# Altium project BaseBoard.PrjPcb
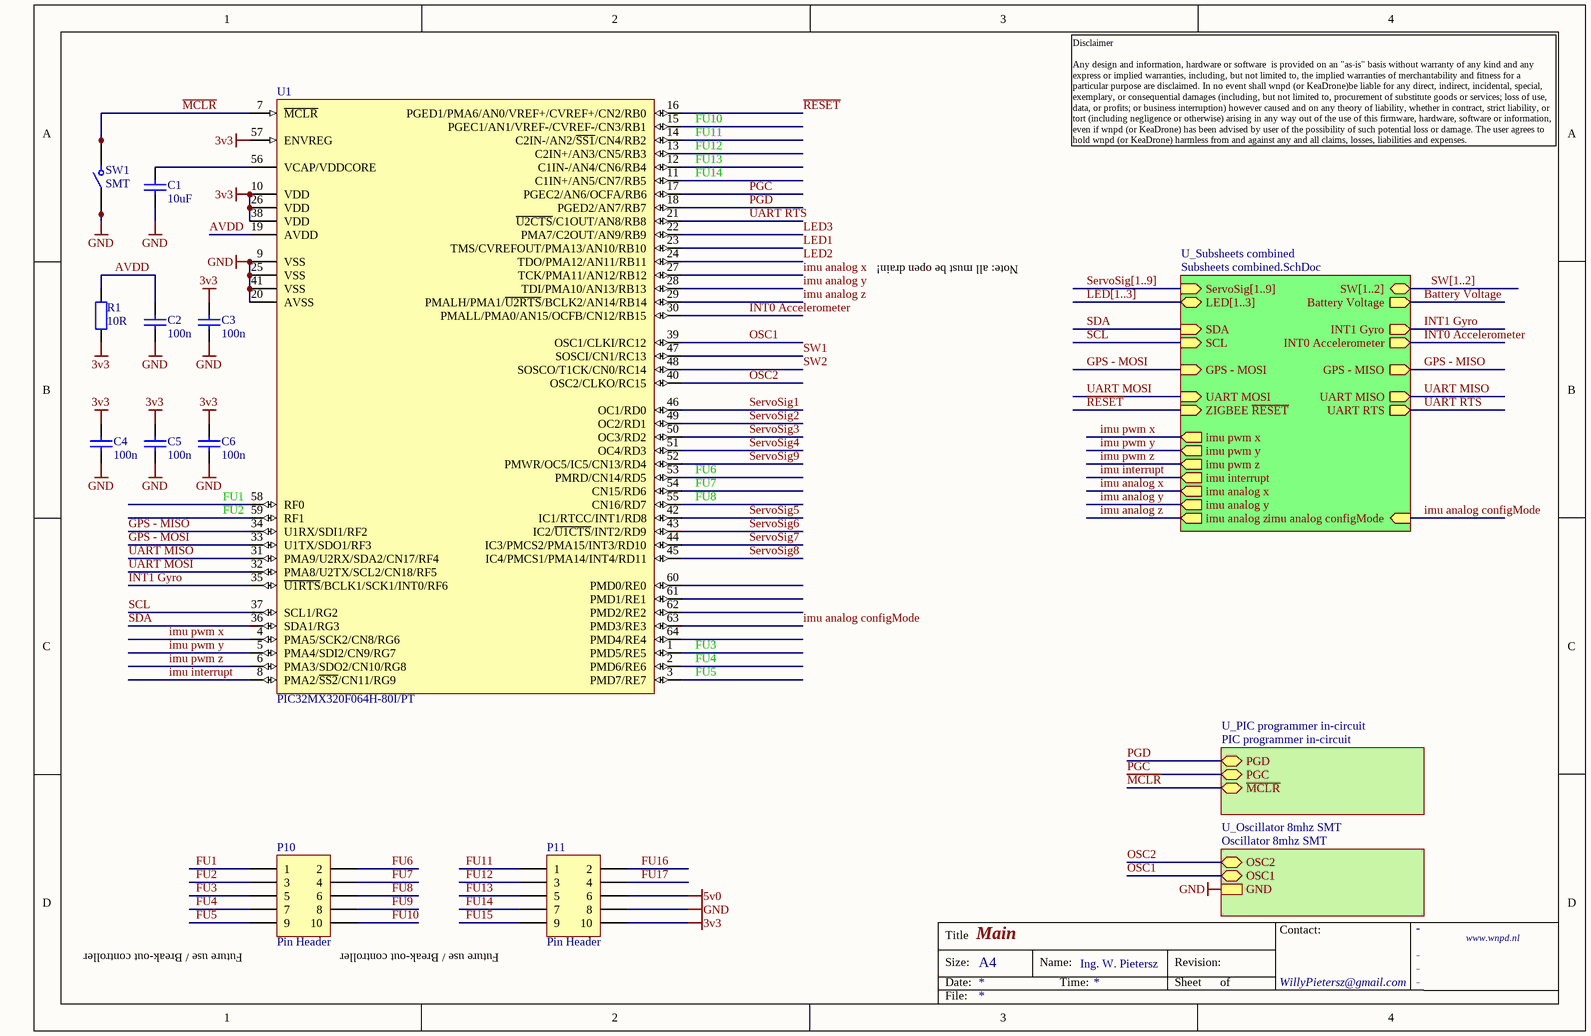
[diagram p0: main.SchDoc]
6 sheets, 68 parts. Net scope: hierarchical (ports join the sheet entries above them; power ports are global).
Board file: BaseBoard.PcbDoc
Sheets:
  main.SchDoc
    U_Subsheets combined = Subsheets combined.SchDoc
      U_Accelerometer 3-AXIS - BMA180 = Accelerometer 3-AXIS - BMA180.SchDoc
      PSU 3v3 = Regulator 3v3-250mA MCP1702.SchDoc
      PWR Entry = Power Entry 24v-3pin Fused-1A5.SchDoc
      PSU 3v3A = Regulator 3v3-250mA MCP1702.SchDoc
      ServoConnector1 = ServoConnector.SchDoc
      ServoConnector2 = ServoConnector.SchDoc
      ServoConnector3 = ServoConnector.SchDoc
      ServoConnector4 = ServoConnector.SchDoc
      ServoConnector5 = ServoConnector.SchDoc
      ServoConnector6 = ServoConnector.SchDoc
      ServoConnector7 = ServoConnector.SchDoc
      ServoConnector8 = ServoConnector.SchDoc
      ServoConnector9 = ServoConnector.SchDoc

## Sheet main.SchDoc: Main
size A4; PageSetup: Record=PageOptions|CenterHorizontal=True|CenterVertical=True|PrintScale=0.97|XCorrection=1.00|YCorrection=1.00|PrintKind=0|BorderSize=5000000|LeftOffset=0|BottomOffset=0|Orientation=2|PaperLength=1000|PaperWidth=1000|Scale=100|PaperSource=273|PrintQuality=-2|MediaType=1|DitherType=10|PaperKind=A4|PrintScaleMode=1; Organization: Altium Limited; Address1: 3 Minna Close; Address2: Belrose; Address3: NSW 2085; Address4: Australia; DocumentName: test

### Parts
C1  10uF  [C1206]
C2  100n  [C0805]
C3  100n  [C0805]
C4  100n  [C0805]
C5  100n  [C0805]
C6  100n  [C0805]
P10  Pin Header  [PH2x5_2.54]
P11  Pin Header  [PH2x5_2.54]
R1  value 10R  [R0805]  (hidden comment: RESISTOR)
SW1  SMT  [SWITCH TACT]
U1  PIC32MX320F064H-80I/PT  [TQFP-PT64_N]

### Sub-sheets
U_Oscillator 8mhz SMT = Oscillator 8mhz SMT (file not in this document): OSC2 (bidir), OSC1 (bidir), GND
U_PIC programmer in-circuit = PIC programmer in-circuit (file not in this document): PGD (bidir), PGC (bidir), ~{MCLR} (bidir)
U_Subsheets combined = Subsheets combined.SchDoc: ServoSig[1..9], INT0 Accelerometer (out), INT1 Gyro (out), UART MISO (out), UART MOSI (in), ZIGBEE ~{RESET} (in), SDA (in), SCL (in), Battery Voltage (out), GPS - MISO (out), GPS - MOSI (in), LED[1..3] (bidir), SW[1..2], imu pwm x (out), imu pwm y (out), imu pwm z (out), imu interrupt (out), imu analog x (out), imu analog y (out), imu analog z (out), imu analog configMode (in), UART RTS (out)

### Nets
3v3: C3.2 C4.2 C5.2 C6.2 P11.10 R1.2 U1.10(VDD) U1.26(VDD) U1.38(VDD) U1.57(ENVREG)
5v0: P11.6
GND: C1.1 C2.1 C3.1 C4.1 C5.1 C6.1 P11.8 SW1.1 SW1.4 U1.9(VSS) U1.20(AVSS) U1.25(VSS) U1.41(VSS) ; sheet U_Oscillator 8mhz SMT/GND
AVDD: C2.2 R1.1 U1.19(AVDD)
Battery Voltage: sheet U_Subsheets combined/Battery Voltage
FU1: P10.1 U1.58(RF0)
FU2: P10.3 U1.59(RF1)
FU3: P10.5 U1.1(PMD5/RE5)
FU4: P10.7 U1.2(PMD6/RE6)
FU5: P10.9 U1.3(PMD7/RE7)
FU6: P10.2 U1.53(PMRD/CN14/RD5)
FU7: P10.4 U1.54(CN15/RD6)
FU8: P10.6 U1.55(CN16/RD7)
FU9: P10.8
FU10: P10.10 U1.15(PGEC1/AN1/VREF-/CVREF-/CN3/RB1)
FU11: P11.1 U1.14(C2IN-/AN2/~{SS1}/CN4/RB2)
FU12: P11.3 U1.13(C2IN+/AN3/CN5/RB3)
FU13: P11.5 U1.12(C1IN-/AN4/CN6/RB4)
FU14: P11.7 U1.11(C1IN+/AN5/CN7/RB5)
FU15: P11.9
FU16: P11.2
FU17: P11.4
GPS - MISO: U1.34(U1RX/SDI1/RF2) ; sheet U_Subsheets combined/GPS - MISO
GPS - MOSI: U1.33(U1TX/SDO1/RF3) ; sheet U_Subsheets combined/GPS - MOSI
imu analog configMode: U1.63(PMD3/RE3) ; sheet U_Subsheets combined/imu analog configMode
imu analog x: U1.27(TCK/PMA11/AN12/RB12) ; sheet U_Subsheets combined/imu analog x
imu analog y: U1.28(TDI/PMA10/AN13/RB13) ; sheet U_Subsheets combined/imu analog y
imu analog z: U1.29(PMALH/PMA1/~{U2RTS}/BCLK2/AN14/RB14) ; sheet U_Subsheets combined/imu analog z
imu interrupt: U1.8(PMA2/~{SS2}/CN11/RG9) ; sheet U_Subsheets combined/imu interrupt
imu pwm x: U1.4(PMA5/SCK2/CN8/RG6) ; sheet U_Subsheets combined/imu pwm x
imu pwm y: U1.5(PMA4/SDI2/CN9/RG7) ; sheet U_Subsheets combined/imu pwm y
imu pwm z: U1.6(PMA3/SDO2/CN10/RG8) ; sheet U_Subsheets combined/imu pwm z
INT0 Accelerometer: U1.30(PMALL/PMA0/AN15/OCFB/CN12/RB15) ; sheet U_Subsheets combined/INT0 Accelerometer
INT1 Gyro: U1.35(~{U1RTS}/BCLK1/SCK1/INT0/RF6) ; sheet U_Subsheets combined/INT1 Gyro
LED1: U1.23(TMS/CVREFOUT/PMA13/AN10/RB10)
LED2: U1.24(TDO/PMA12/AN11/RB11)
LED3: U1.22(PMA7/C2OUT/AN9/RB9)
~{MCLR}: SW1.2 SW1.3 U1.7(~{MCLR}) ; sheet U_PIC programmer in-circuit/~{MCLR}
OSC1: U1.39(OSC1/CLKI/RC12) ; sheet U_Oscillator 8mhz SMT/OSC1
OSC2: U1.40(OSC2/CLKO/RC15) ; sheet U_Oscillator 8mhz SMT/OSC2
PGC: U1.17(PGEC2/AN6/OCFA/RB6) ; sheet U_PIC programmer in-circuit/PGC
PGD: U1.18(PGED2/AN7/RB7) ; sheet U_PIC programmer in-circuit/PGD
~{RESET}: U1.16(PGED1/PMA6/AN0/VREF+/CVREF+/CN2/RB0) ; sheet U_Subsheets combined/ZIGBEE ~{RESET}
SCL: U1.37(SCL1/RG2) ; sheet U_Subsheets combined/SCL
SDA: U1.36(SDA1/RG3) ; sheet U_Subsheets combined/SDA
ServoSig1: U1.46(OC1/RD0)
ServoSig2: U1.49(OC2/RD1)
ServoSig3: U1.50(OC3/RD2)
ServoSig4: U1.51(OC4/RD3)
ServoSig5: U1.42(IC1/RTCC/INT1/RD8)
ServoSig6: U1.43(IC2/~{U1CTS}/INT2/RD9)
ServoSig7: U1.44(IC3/PMCS2/PMA15/INT3/RD10)
ServoSig8: U1.45(IC4/PMCS1/PMA14/INT4/RD11)
ServoSig9: U1.52(PMWR/OC5/IC5/CN13/RD4)
SW1: U1.47(SOSCI/CN1/RC13)
SW2: U1.48(SOSCO/T1CK/CN0/RC14)
UART MISO: U1.31(PMA9/U2RX/SDA2/CN17/RF4) ; sheet U_Subsheets combined/UART MISO
UART MOSI: U1.32(PMA8/U2TX/SCL2/CN18/RF5) ; sheet U_Subsheets combined/UART MOSI
UART RTS: U1.21(~{U2CTS}/C1OUT/AN8/RB8) ; sheet U_Subsheets combined/UART RTS
NetC1_2: C1.2 U1.56(VCAP/VDDCORE)

Not connected (* = marked no-connect by the designer): U1 60(PMD0/RE0) 61(PMD1/RE1) 62(PMD2/RE2) 64(PMD4/RE4)

### Buses and harness runs
bus LED[1..3] = sheet U_Subsheets combined/LED[1..3]
bus ServoSig[1..9] = sheet U_Subsheets combined/ServoSig[1..9]
bus SW[1..2] = sheet U_Subsheets combined/SW[1..2]

### Notes on the sheet
- Note: all must be open drain!
- (near P10) Future use / Break-out controller
- (near P11) Future use / Break-out controller
- Disclaimer
  Any design and information, hardware or software  is provided on an "as-is" basis without warranty of any kind and any express or implied warranties, including, but not limited to, the implied warranties of merchantability and fitness for a particular purpose are disclaimed. In no event shall wnpd (or KeaDrone)be liable for any direct, indirect, incidental, special, exemplary, or consequential damages (including, but not limited to, procurement of substitute goods or services; loss of use, data, or profits; or business interruption) however caused and on any theory of liability, whether in contract, strict liability, or tort (including negligence or otherwise) arising in any way out of the use of this firmware, hardware, software or information, even if wnpd (or KeaDrone) has been advised by user of the possibility of such potential loss or damage. The user agrees to hold wnpd (or KeaDrone) harmless from and against any and all claims, losses, liabilities and expenses.
- Title
- Size:
- Date:
- A4
- Name:
- Time:
- Ing. W. Pietersz
- Revision:
- Sheet
- of
- WillyPietersz@gmail.com
- Contact:
- -
- www.wnpd.nl
- File:

### Library data of the parts
C1 = 10uF: Voltage: 10V; Type: Ceramic; Tolerance: 0.1; LatestRevision Note: Initial Release; Part Number: 10uF; Value: 10uF; Package: 1206; Component Type: Standard; LatestRevision Date: 14-9-2010; Author: Willem Pietersz; Supplier 1: Farnell; Supplier Part Number 1: 1759434; ComponentLink1Description: Manufacturer; ComponentLink2Description: Datasheet
C2-C6 = 100n: Tolerance: 0.1; LatestRevision Note: Initial Release; Part Number: 100n; Value: 100n; Package: 0805; Component Type: Standard; LatestRevision Date: 31-7-2010; Author: Willy Pietersz; Supplier 1: Farnell; Supplier Part Number 1: 1759266; ComponentLink1Description: Manufacturer; ComponentLink2Description: Datasheet
P10 P11 = PH2x5: Header, 5-Pin, Dual row; Part Number: PH2x5; Pitch: 2.54; LatestRevision Note: Initial Release; Type: Pin Header; Number Of Pins: 10; Component Type: Standard; LatestRevision Date: 23-11-2010; Author: Willy Pietersz; Supplier 1: Farnell
R1 = 10R: Manufacturer 1: Panasonic; Manufacturer 1 Part No: ERJT06J100V; Power: 0.25W; Tolerance: 0.05; LatestRevision Note: Initial Release; Published: 8-Jun-2000; LatestRevisionDate: 17-Jul-2002; LatestRevisionNote: Re-released for DXP Platform.; PackageReference: AXIAL-0.4; Publisher: Altium Limited; Part Number: 10R; Type: Film; Package: 0805; Component Type: Standard; LatestRevision Date: 30-7-2010; Author: Willy Pietersz; ROHS: Y; Supplier 1: Farnell; Supplier Part Number 1: 1618239; ComponentLink1Description: Manufacturer; ComponentLink2Description: Datasheet
SW1 = Pushbutton TACT: Switch; Current: 0.1; Voltage: 42; LatestRevision Note: Initial Release; Part Number: Pushbutton TACT; Component Type: Switch; LatestRevision Date: 4-10-2010; Author: Willem Pietersz; Supplier 2: Farnell; Supplier Part Number 2: 1795335; Number Of Pins: 4
U1 = PIC32MX320F064H-80I/PT: High Performance 80 MHz MIPS-Based 32-Bit Flash Microcontroller, 64KB Program Memory, 64-pin TQFP; FirstPublished: 29-Jan-2009; LatestRevisionDate: 2-Dec-2009; LatestRevisionNote: Datasheet updated to version revF, Jun-2009.; DatasheetVersion: revF, Jun-2009; PackageVersion: revBB, Aug-2009; PackageReference: TQFP-PT64; Publisher: Altium Limited; PackageDescription: 64-Lead Thin Plastic Quad Flat Pack (PT) - 10x10x1mm Body, 2.00mm [TQFP]; Supplier 1: Digi-Key; Supplier Part Number 1: PIC32MX320F064H-80I/PT-ND; Supplier 2: Farnell; Supplier Part Number 2: 1523319; Supplier 3: Newark; Supplier Part Number 3: 77M3147; Code_JEDEC: MS-026; ComponentLink1Description: Datasheet; ComponentLink1URL: http://ww1.microchip.com/downloads/en/DeviceDoc/61143F.pdf; ComponentLink2Description: Packaging Specification; ComponentLink2URL: http://ww1.microchip.com/downloads/en/PackagingSpec/en012702.pdf; ComponentLink3Description: Microchip.com Home; ComponentLink3URL: http://www.microchip.com/

## Sheet Subsheets combined.SchDoc: Subsheets Combined
size A4; Organization: Altium Limited; Address1: 3 Minna Close; Address2: Belrose; Address3: NSW 2085; Address4: Australia
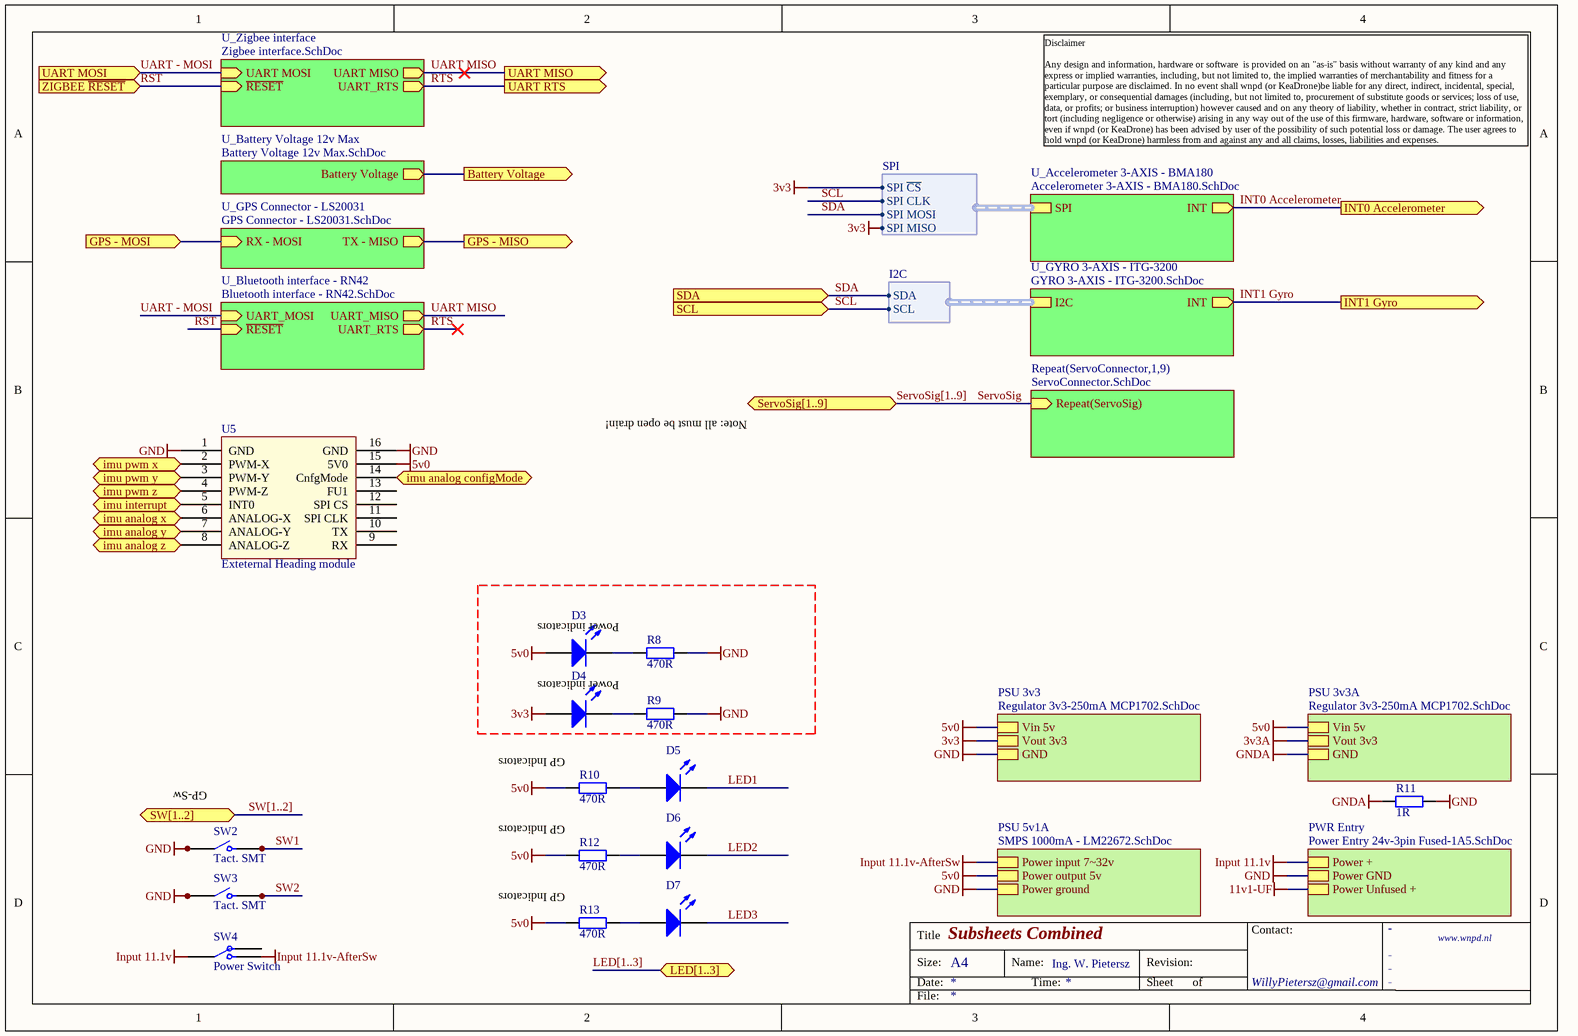
[diagram p1: Subsheets combined.SchDoc]

### Parts
(Parts that share a designator on the sheet are numbered #1, #2 ... from top to bottom, then left to right.)
D3  (no value)  [PLCC2]
D4  (no value)  [PLCC2]
D5  (no value)  [PLCC2]
D6  (no value)  [PLCC2]
D7  (no value)  [PLCC2]
R8  value 470R  [R0805]  (hidden comment: RESISTOR)
R9#1  value 470R  [R0805]  (hidden comment: RESISTOR)
R10#1  value 470R  [R0805]  (hidden comment: RESISTOR)
R11#1  value 1R  [R0805]  (hidden comment: RESISTOR)
R12#1  value 470R  [R0805]  (hidden comment: RESISTOR)
R13#1  value 470R  [R0805]  (hidden comment: RESISTOR)
SW2  Tact. SMT  [SWITCH TACT]
SW3  Tact. SMT  [SWITCH TACT]
SW4  Power Switch  [1MS1T1B5M1QE]
U5  Exteternal Heading module  [Keadrone_IMUv1]

### Sub-sheets
PSU 3v3 = Regulator 3v3-250mA MCP1702.SchDoc: Vin 5v, Vout 3v3, GND
PSU 3v3A = Regulator 3v3-250mA MCP1702.SchDoc: Vin 5v, Vout 3v3, GND
PSU 5v1A = SMPS 1000mA - LM22672.SchDoc (file not in this document): Power input 7~32v, Power output 5v, Power ground
PWR Entry = Power Entry 24v-3pin Fused-1A5.SchDoc: Power +, Power GND, Power Unfused +
Repeat(ServoConnector,1,9) = ServoConnector.SchDoc: Repeat(ServoSig) (in)
U_Accelerometer 3-AXIS - BMA180 = Accelerometer 3-AXIS - BMA180.SchDoc: INT (out), SPI (harness SPI)
U_Battery Voltage 12v Max = Battery Voltage 12v Max.SchDoc (file not in this document): Battery Voltage (out)
U_Bluetooth interface - RN42 = Bluetooth interface - RN42.SchDoc (file not in this document): UART_MOSI (in), UART_MISO (out), UART_RTS (out), ~{RESET} (in)
U_GPS Connector - LS20031 = GPS Connector - LS20031.SchDoc (file not in this document): RX - MOSI (in), TX - MISO (out)
U_GYRO 3-AXIS - ITG-3200 = GYRO 3-AXIS - ITG-3200.SchDoc (file not in this document): INT (out), I2C (harness I2C)
U_Zigbee interface = Zigbee interface.SchDoc (file not in this document): UART MISO (out), UART MOSI (in), ~{RESET} (in), UART_RTS (out)

### Ports
Battery Voltage (out), GPS - MISO (out), GPS - MOSI (in), imu analog configMode (in), imu analog x (out), imu analog y (out), imu analog z (out), imu interrupt (out), imu pwm x (out), imu pwm y (out), imu pwm z (out), INT0 Accelerometer (out), INT1 Gyro (out), LED[1..3] (bidir), SCL (in), SDA (in), ServoSig[1..9], SW[1..2], UART MISO (out), UART MOSI (in), UART RTS (out), ZIGBEE ~{RESET} (in)

### Harnesses
SPI: SPI ~{CS}, SPI CLK, SPI MOSI, SPI MISO
I2C: SDA, SCL

### Nets
3v3: D4.1(A) ; sheet PSU 3v3/Vout 3v3, sheet U_Accelerometer 3-AXIS - BMA180/SPI.SPI ~{CS}, sheet U_Accelerometer 3-AXIS - BMA180/SPI.SPI MISO
5v0: D3.1(A) R10#1.2 R12#1.2 R13#1.2 U5.15(5V0) ; sheet PSU 5v1A/Power output 5v, sheet PSU 3v3/Vin 5v, sheet PSU 3v3A/Vin 5v
GND: R8.1 R9#1.1 R11#1.2 SW2.1 SW2.4 SW3.1 SW3.4 U5.1(GND) U5.16(GND) ; sheet PSU 5v1A/Power ground, sheet PSU 3v3/GND, sheet PWR Entry/Power GND
GNDA: R11#1.1 ; sheet PSU 3v3A/GND
Input 11.1v: SW4.1 ; sheet PWR Entry/Power +
Input 11.1v-AfterSw: SW4.2 ; sheet PSU 5v1A/Power input 7~32v
Battery Voltage: port Battery Voltage, sheet U_Battery Voltage 12v Max/Battery Voltage
GPS - MISO: port GPS - MISO, sheet U_GPS Connector - LS20031/TX - MISO
GPS - MOSI: port GPS - MOSI, sheet U_GPS Connector - LS20031/RX - MOSI
imu analog configMode: U5.14(CnfgMode) ; port imu analog configMode
imu analog x: U5.6(ANALOG-X) ; port imu analog x
imu analog y: U5.7(ANALOG-Y) ; port imu analog y
imu analog z: U5.8(ANALOG-Z) ; port imu analog z
imu interrupt: U5.5(INT0) ; port imu interrupt
imu pwm x: U5.2(PWM-X) ; port imu pwm x
imu pwm y: U5.3(PWM-Y) ; port imu pwm y
imu pwm z: U5.4(PWM-Z) ; port imu pwm z
INT0 Accelerometer: port INT0 Accelerometer, sheet U_Accelerometer 3-AXIS - BMA180/INT
INT1 Gyro: port INT1 Gyro, sheet U_GYRO 3-AXIS - ITG-3200/INT
LED1: D5.2(K)
LED2: D6.2(K)
LED3: D7.2(K)
RST: port ZIGBEE ~{RESET}, sheet U_Zigbee interface/~{RESET}, sheet U_Bluetooth interface - RN42/~{RESET}  [project net ~{RESET}]
RTS: port UART RTS, sheet U_Zigbee interface/UART_RTS, sheet U_Bluetooth interface - RN42/UART_RTS  [project net UART RTS]
SCL: port SCL, sheet U_Accelerometer 3-AXIS - BMA180/SPI.SPI CLK, sheet U_GYRO 3-AXIS - ITG-3200/I2C.SCL
SDA: port SDA, sheet U_Accelerometer 3-AXIS - BMA180/SPI.SPI MOSI, sheet U_GYRO 3-AXIS - ITG-3200/I2C.SDA
ServoSig: sheet Repeat(ServoConnector,1,9)/Repeat(ServoSig)
SW1: SW2.2 SW2.3
SW2: SW3.2 SW3.3
UART - MOSI: port UART MOSI, sheet U_Zigbee interface/UART MOSI, sheet U_Bluetooth interface - RN42/UART_MOSI  [project net UART MOSI]
UART MISO: port UART MISO, sheet U_Zigbee interface/UART MISO, sheet U_Bluetooth interface - RN42/UART_MISO
NetD3_2: D3.2(K) R8.2
NetD4_2: D4.2(K) R9#1.2
NetD5_1: D5.1(A) R10#1.1
NetD6_1: D6.1(A) R12#1.1
NetD7_1: D7.1(A) R13#1.1

Not connected (* = marked no-connect by the designer): SW4 3; U5 9(RX) 10(TX) 11(SPI_CLK) 12(SPI_CS) 13(FU1)

### Buses and harness runs
bus LED[1..3] = port LED[1..3]
bus ServoSig[1..9] = port ServoSig[1..9]
bus SW[1..2] = port SW[1..2]

### Notes on the sheet
- Note: all must be open drain!
- (near R8) Power indicators
- Power indicators
- (near SW2) GP-Sw
- GP Indicators
- Disclaimer
  Any design and information, hardware or software  is provided on an "as-is" basis without warranty of any kind and any express or implied warranties, including, but not limited to, the implied warranties of merchantability and fitness for a particular purpose are disclaimed. In no event shall wnpd (or KeaDrone)be liable for any direct, indirect, incidental, special, exemplary, or consequential damages (including, but not limited to, procurement of substitute goods or services; loss of use, data, or profits; or business interruption) however caused and on any theory of liability, whether in contract, strict liability, or tort (including negligence or otherwise) arising in any way out of the use of this firmware, hardware, software or information, even if wnpd (or KeaDrone) has been advised by user of the possibility of such potential loss or damage. The user agrees to hold wnpd (or KeaDrone) harmless from and against any and all claims, losses, liabilities and expenses.
- Title
- Size:
- Date:
- A4
- Name:
- Time:
- Ing. W. Pietersz
- Revision:
- Sheet
- of
- WillyPietersz@gmail.com
- Contact:
- -
- www.wnpd.nl
- File:

### Library data of the parts
D3-D7 = Green-PLCC2: LED, Surface Mount LED Indicator; Type: Single_Indicator; Part Number: Green-PLCC2; Author: Willem Pietersz; ROHS: Y; Supplier 2: Farnell; Supplier Part Number 2: 1328317; ComponentLink2Description: Datasheet; ComponentLink2URL: http://cp.literature.agilent.com/litweb/pdf/5988-6546EN.pdf
R8 R9#1 R10#1 R12#1 R13#1 = 470R: Manufacturer 1: Panasonic; Manufacturer 1 Part No: ERJT06J471V; Power: 0.25W; Tolerance: 0.05; LatestRevision Note: Initial Release; Published: 8-Jun-2000; LatestRevisionDate: 17-Jul-2002; LatestRevisionNote: Re-released for DXP Platform.; PackageReference: AXIAL-0.4; Publisher: Altium Limited; Part Number: 470R; Type: Film; Package: 0805; Component Type: Standard; LatestRevision Date: 30-7-2010; Author: Willy Pietersz; ROHS: Y; Supplier 1: Farnell; Supplier Part Number 1: 1577367; ComponentLink1Description: Manufacturer; ComponentLink2Description: Datasheet
R11#1 = 1R: Manufacturer 1: Panasonic; Manufacturer 1 Part No: ERJT06J1R0V; Power: 0.25W; Tolerance: 0.05; LatestRevision Note: Initial Release; Published: 8-Jun-2000; LatestRevisionDate: 17-Jul-2002; LatestRevisionNote: Re-released for DXP Platform.; PackageReference: AXIAL-0.4; Publisher: Altium Limited; Part Number: 1R; Type: Film; Package: 0805; Component Type: Standard; LatestRevision Date: 30-7-2010; Author: Willy Pietersz; ROHS: Y; Supplier 2: Farnell; Supplier Part Number 2: 1618236; ComponentLink1Description: Manufacturer; ComponentLink2Description: Datasheet
SW2 SW3 = Pushbutton TACT: as SW1 on sheet main; Part Number: Pushbutton TACT; Component Type: Switch; LatestRevision Date: 4-10-2010; Author: Willem Pietersz; Supplier 1: Farnell; Supplier Part Number 1: 1795335; Number Of Pins: 4
SW4 = Toggle-Sw_1MS1T1B5M1QE: Switch; Current: 2; Voltage: 250; Part Number: Toggle-Sw_1MS1T1B5M1QE; Type: SPDT; Component Type: Switch; Supplier 1: Farnell; Supplier Part Number 1: 9473378; ComponentLink2Description: Datasheet; ComponentLink2URL: http://www.farnell.com/datasheets/650672.pdf; Number Of Pins: 3
U5 = Keadrone-imu-v1: Part Number: Keadrone-imu-v1; Component Type: Gyro, IMU

## Sheet Accelerometer 3-AXIS - BMA180.SchDoc: Accelerometer, 3-Axis - SPI
size A4; Organization: Altium Limited; Address1: 3 Minna Close; Address2: Belrose; Address3: NSW 2085; Address4: Australia
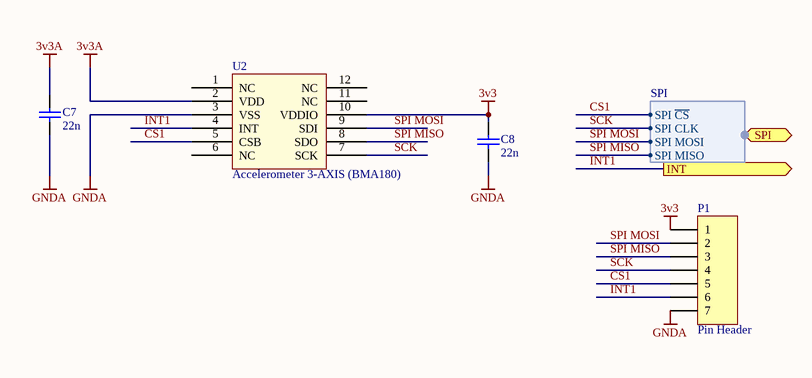
[diagram p2: Accelerometer 3-AXIS - BMA180.SchDoc]

### Parts
C7  22n  [C0805]
C8  22n  [C0805]
P1  Pin Header  [PH1x7_2.54]
U2  Accelerometer 3-AXIS (BMA180)  [BMA180]

### Ports
INT (out), SPI (harness SPI)

### Harnesses
SPI: SPI ~{CS}, SPI CLK, SPI MOSI, SPI MISO

### Nets
3v3: C8.2 P1.1 P1.3 P1.5 U2.5(CSB) U2.8(SDO) U2.10(VDDIO) ; port SPI.SPI ~{CS}, port SPI.SPI MISO  [also labelled CS1, SPI MISO]
3v3A: C7.2 U2.2(VDD)
GNDA: C7.1 C8.1 P1.7 U2.3(VSS)
INT1: P1.6 U2.4(INT) ; port INT  [project net INT0 Accelerometer]
SCK: P1.4 U2.7(SCK) ; port SPI.SPI CLK  [project net SCL]
SPI MOSI: P1.2 U2.9(SDI) ; port SPI.SPI MOSI  [project net SDA]

Not connected (* = marked no-connect by the designer): U2 1(NC) 6(NC) 11(NC) 12(NC)

### Notes on the sheet
- Disclaimer
  Any design and information, hardware or software  is provided on an "as-is" basis without warranty of any kind and any express or implied warranties, including, but not limited to, the implied warranties of merchantability and fitness for a particular purpose are disclaimed. In no event shall wnpd (or KeaDrone)be liable for any direct, indirect, incidental, special, exemplary, or consequential damages (including, but not limited to, procurement of substitute goods or services; loss of use, data, or profits; or business interruption) however caused and on any theory of liability, whether in contract, strict liability, or tort (including negligence or otherwise) arising in any way out of the use of this firmware, hardware, software or information, even if wnpd (or KeaDrone) has been advised by user of the possibility of such potential loss or damage. The user agrees to hold wnpd (or KeaDrone) harmless from and against any and all claims, losses, liabilities and expenses.
- Title
- Size:
- Date:
- A4
- Name:
- Time:
- Ing. W. Pietersz
- Revision:
- Sheet
- of
- WillyPietersz@gmail.com
- Contact:
- -
- www.wnpd.nl
- File:

### Library data of the parts
C7 C8 = 22n: Tolerance: 0.1; LatestRevision Note: Initial Release; Part Number: 22n; Value: 22n; Package: 0805; Component Type: Standard; LatestRevision Date: 31-7-2010; Author: Willy Pietersz; ComponentLink1Description: Manufacturer; ComponentLink2Description: Datasheet
P1 = PH1x7: Con1x7; Part Number: PH1x7; Pitch: 2.54; LatestRevision Note: Initial Release; Type: Pin Header; Number Of Pins: 7; Component Type: Standard; LatestRevision Date: 23-11-2010; Author: Willy Pietersz; Supplier 2: Farnell
U2 = BMA180: Part Number: BMA180; Component Type: Sensor; Supplier 1: Digikey; Supplier Part Number 1: 828-1019-1-ND; ComponentLink1Description: Datasheet; ComponentLink1URL: http://www.bosch-sensortec.com/content/language1/downloads/BST-BMA180-FL000-03.pdf

## Sheet Regulator 3v3-250mA MCP1702.SchDoc: Regulator 3v3 out
size A4; Organization: Altium Limited; Address1: 3 Minna Close; Address2: Belrose; Address3: NSW 2085; Address4: Australia
Used 2 times, as channels U_Subsheets combined/PSU 3v3, U_Subsheets combined/PSU 3v3A. Parts and nets are listed once, with the designators drawn on the sheet.
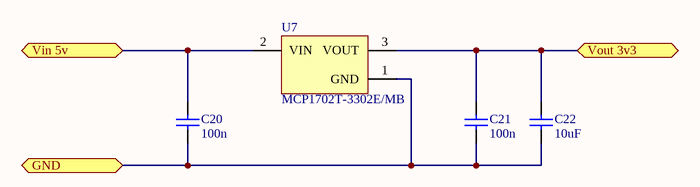
[diagram p3: Regulator 3v3-250mA MCP1702.SchDoc]

### Parts
C20  100n  [C0805]
C21  100n  [C0805]
C22  10uF  [C1206]
U7  MCP1702T-3302E/MB  [SOT-89-MB3_N]

### Ports
GND, Vin 5v, Vout 3v3

### Nets
GND: C20.1 C21.1 C22.1 U7.1(GND) ; port GND
Vin 5v: C20.2 U7.2(VIN) ; port Vin 5v
Vout 3v3: C21.2 C22.2 U7.3(VOUT) ; port Vout 3v3

### Channels
U_Subsheets combined/PSU 3v3: designators C20=C31 C21=C30 C22=C29 U7=U9; ports GND=GND Vin 5v=5v0 Vout 3v3=3v3
U_Subsheets combined/PSU 3v3A: designators C20=C25 C21=C26 C22=C24 U7=U7; ports GND=GNDA Vin 5v=5v0 Vout 3v3=3v3A

### Notes on the sheet
- Disclaimer
  Any design and information, hardware or software  is provided on an "as-is" basis without warranty of any kind and any express or implied warranties, including, but not limited to, the implied warranties of merchantability and fitness for a particular purpose are disclaimed. In no event shall wnpd (or KeaDrone)be liable for any direct, indirect, incidental, special, exemplary, or consequential damages (including, but not limited to, procurement of substitute goods or services; loss of use, data, or profits; or business interruption) however caused and on any theory of liability, whether in contract, strict liability, or tort (including negligence or otherwise) arising in any way out of the use of this firmware, hardware, software or information, even if wnpd (or KeaDrone) has been advised by user of the possibility of such potential loss or damage. The user agrees to hold wnpd (or KeaDrone) harmless from and against any and all claims, losses, liabilities and expenses.
- Title
- Size:
- Date:
- A4
- Name:
- Time:
- Ing. W. Pietersz
- Revision:
- Sheet
- of
- WillyPietersz@gmail.com
- Contact:
- -
- www.wnpd.nl
- File:

### Library data of the parts
C20 C21 = 100n: as C2 on sheet main; Part Number: 100n; Value: 100n; Package: 0805; Component Type: Standard; LatestRevision Date: 31-7-2010; Author: Willy Pietersz; Supplier 2: Farnell; Supplier Part Number 2: 1759266; ComponentLink1Description: Manufacturer; ComponentLink2Description: Datasheet
C22 = 10uF: as C1 on sheet main; Part Number: 10uF; Value: 10uF; Package: 1206; Component Type: Standard; LatestRevision Date: 14-9-2010; Author: Willem Pietersz; Supplier 2: Farnell; Supplier Part Number 2: 1759434; ComponentLink1Description: Manufacturer; ComponentLink2Description: Datasheet
U7 = MCP1702T-3302E/MB: Power, 250 mA Low Quiescent Current LDO Regulator, 3-Pin SOT-89, Extended Temperature, Tape and Reel; FirstPublished: 29-Jan-2009; LatestRevisionDate: 02-Dec-2009; LatestRevisionNote: Updated to datasheet revision D, Jun-2009; DatasheetVersion: revD, Jun-2009; PackageVersion: revBB, Aug-2009; PackageReference: SOT-89-MB3; Publisher: Altium Limited; PackageDescription: 3-Lead Plastic Small Outline Transistor Header (MB) [SOT-89]; Supplier 1: Digi-Key; Supplier Part Number 1: MCP1702T-3302E/MB-ND; Supplier 2: Farnell; Supplier Part Number 2: 1605558; Supplier 3: Newark; Supplier Part Number 3: 56K6993; Code_IPC: SOT89; ComponentLink1Description: Datasheet; ComponentLink1URL: http://ww1.microchip.com/downloads/en/DeviceDoc/22008d.pdf; ComponentLink2Description: Packaging Specification; ComponentLink2URL: http://www.microchip.com/stellent/groups/techpub_sg/documents/packagingspec/en012702.pdf; ComponentLink3Description: Microchip.com Home; ComponentLink3URL: http://www.microchip.com/

## Sheet Power Entry 24v-3pin Fused-1A5.SchDoc: Power Supply Entry
size A4; Organization: Altium Limited; Address1: 3 Minna Close; Address2: Belrose; Address3: NSW 2085; Address4: Australia
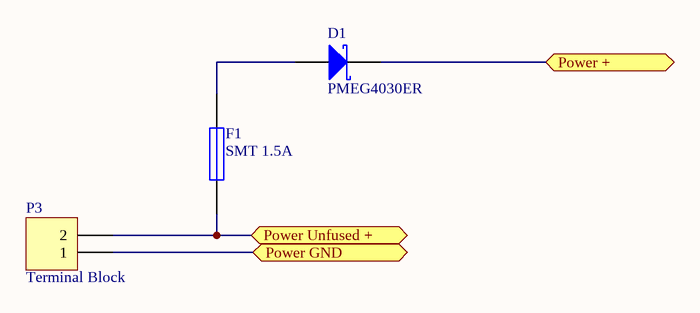
[diagram p4: Power Entry 24v-3pin Fused-1A5.SchDoc]

### Parts
D1  PMEG4030ER  [SOD123W]
F1  SMT 1.5A  [F_2920L185]
P3  Terminal Block  [TB2_3.5]

### Ports
Power +, Power GND, Power Unfused +

### Nets
11v1-UF: F1.1 P3.2 ; port Power Unfused +
GND: P3.1 ; port Power GND
Input 11.1v: D1.2 ; port Power +
NetD1_1: D1.1 F1.2

### Notes on the sheet
- Disclaimer
  Any design and information, hardware or software  is provided on an "as-is" basis without warranty of any kind and any express or implied warranties, including, but not limited to, the implied warranties of merchantability and fitness for a particular purpose are disclaimed. In no event shall wnpd (or KeaDrone)be liable for any direct, indirect, incidental, special, exemplary, or consequential damages (including, but not limited to, procurement of substitute goods or services; loss of use, data, or profits; or business interruption) however caused and on any theory of liability, whether in contract, strict liability, or tort (including negligence or otherwise) arising in any way out of the use of this firmware, hardware, software or information, even if wnpd (or KeaDrone) has been advised by user of the possibility of such potential loss or damage. The user agrees to hold wnpd (or KeaDrone) harmless from and against any and all claims, losses, liabilities and expenses.
- Title
- Size:
- Date:
- A4
- Name:
- Time:
- Ing. W. Pietersz
- Revision:
- Sheet
- of
- WillyPietersz@gmail.com
- Contact:
- -
- www.wnpd.nl
- File:

### Library data of the parts
D1 = PMEG4030ER: Voltage: 40V; Current: 3A; LatestRevision Note: Initial Release; Part Number: PMEG4030ER; Type: Schottky; Package: SOD123W; Component Type: Standard; LatestRevision Date: 29-9-2010 9:43:01; Author: Willem Pietersz; ROHS: Y; Supplier 2: Farnell; Supplier Part Number 2: 1829202; ComponentLink2Description: Datasheet; ComponentLink2URL: http://www.nxp.com/documents/data_sheet/PMEG4030ER.pdf
F1 = 2920L185: Fuse; Manufacturer 1: Littlefuse; Voltage: 30V; Published: 8-Jun-2000; LatestRevisionDate: 17-Jul-2002; LatestRevisionNote: Re-released for DXP Platform.; PackageReference: PIN-W2/E2.8; Publisher: Altium Limited; Part Number: 2920L185; Current: 1.5A; Manufacturer 1 Part No: 2920L185; Supplier 2: Farnell; Supplier Part Number 2: 1822228; ComponentLink1Description: Datasheet; ComponentLink1URL: http://www.farnell.com/datasheets/578244.pdf
P3 = TB2: Con1x2; Part Number: TB2; Current: 10; Voltage: 300; Pitch: 3,5; LatestRevision Note: Initial Release; Type: Terminal Block; Number Of Pins: 2; Component Type: Standard; LatestRevision Date: 23-11-2010; Author: Willy Pietersz; Supplier 2: Farnell

## Sheet ServoConnector.SchDoc: Servo connector in/out
size A4; Organization: Altium Limited; Address1: 3 Minna Close; Address2: Belrose; Address3: NSW 2085; Address4: Australia
Used 9 times, as channels U_Subsheets combined/ServoConnector1, U_Subsheets combined/ServoConnector2, U_Subsheets combined/ServoConnector3, U_Subsheets combined/ServoConnector4, U_Subsheets combined/ServoConnector5, U_Subsheets combined/ServoConnector6, U_Subsheets combined/ServoConnector7, U_Subsheets combined/ServoConnector8, U_Subsheets combined/ServoConnector9. Parts and nets are listed once, with the designators drawn on the sheet.
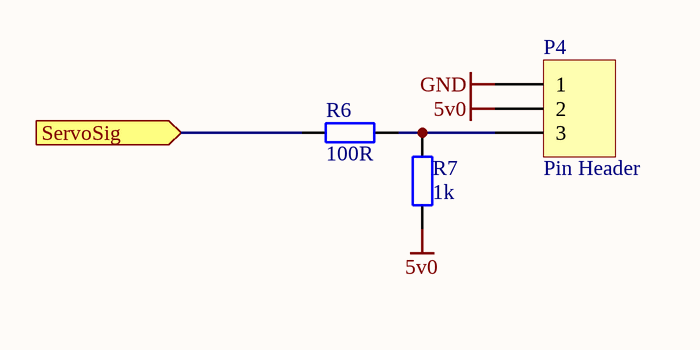
[diagram p5: ServoConnector.SchDoc]

### Parts
P4  Pin Header  [PH1x3_2.54]
R6  value 100R  [R0805]  (hidden comment: RESISTOR)
R7  value 1k  [R0805]  (hidden comment: RESISTOR)

### Ports
ServoSig (in)

### Nets
5v0: P4.2 R7.2
GND: P4.1
ServoSig: R6.2 ; port ServoSig
NetP4_3: P4.3 R6.1 R7.1

### Channels
U_Subsheets combined/ServoConnector1: designators P4=P2 R6=R2 R7=R4; ports ServoSig=ServoSig1
U_Subsheets combined/ServoConnector2: designators P4=P9 R6=R23 R7=R24; ports ServoSig=ServoSig2
U_Subsheets combined/ServoConnector3: designators P4=P20 R6=R30 R7=R31; ports ServoSig=ServoSig3
U_Subsheets combined/ServoConnector4: designators P4=P16 R6=R28 R7=R29; ports ServoSig=ServoSig4
U_Subsheets combined/ServoConnector5: designators P4=P8 R6=R16 R7=R15; ports ServoSig=ServoSig5
U_Subsheets combined/ServoConnector6: designators P4=P7 R6=R13#2 R7=R14; ports ServoSig=ServoSig6
U_Subsheets combined/ServoConnector7: designators P4=P6 R6=R12#2 R7=R11#2; ports ServoSig=ServoSig7
U_Subsheets combined/ServoConnector8: designators P4=P5 R6=R9#2 R7=R10#2; ports ServoSig=ServoSig8
U_Subsheets combined/ServoConnector9: designators P4=P4 R6=R7 R7=R18; ports ServoSig=ServoSig9

### Notes on the sheet
- Disclaimer
  Any design and information, hardware or software  is provided on an "as-is" basis without warranty of any kind and any express or implied warranties, including, but not limited to, the implied warranties of merchantability and fitness for a particular purpose are disclaimed. In no event shall wnpd (or KeaDrone)be liable for any direct, indirect, incidental, special, exemplary, or consequential damages (including, but not limited to, procurement of substitute goods or services; loss of use, data, or profits; or business interruption) however caused and on any theory of liability, whether in contract, strict liability, or tort (including negligence or otherwise) arising in any way out of the use of this firmware, hardware, software or information, even if wnpd (or KeaDrone) has been advised by user of the possibility of such potential loss or damage. The user agrees to hold wnpd (or KeaDrone) harmless from and against any and all claims, losses, liabilities and expenses.
- Title
- Size:
- Date:
- A4
- Name:
- Time:
- Ing. W. Pietersz
- Revision:
- Sheet
- of
- WillyPietersz@gmail.com
- Contact:
- -
- www.wnpd.nl
- File:

### Library data of the parts
P4 = PH1x3: Con1x3; Part Number: PH1x3; Pitch: 2.54; LatestRevision Note: Initial Release; Type: Pin Header; Number Of Pins: 3; Component Type: Standard; LatestRevision Date: 23-11-2010; Author: Willy Pietersz; Supplier 2: Farnell
R6 = 100R: Manufacturer 1: Panasonic; Manufacturer 1 Part No: ERJT06J101V; Power: 0.25W; Tolerance: 0.05; LatestRevision Note: Initial Release; Published: 8-Jun-2000; LatestRevisionDate: 17-Jul-2002; LatestRevisionNote: Re-released for DXP Platform.; PackageReference: AXIAL-0.4; Publisher: Altium Limited; Part Number: 100R; Type: Film; Package: 0805; Component Type: Standard; LatestRevision Date: 30-7-2010; Author: Willy Pietersz; ROHS: Y; Supplier 2: Farnell; Supplier Part Number 2: 1618240; ComponentLink1Description: Manufacturer; ComponentLink2Description: Datasheet
R7 = 1K: Manufacturer 1: Panasonic; Manufacturer 1 Part No: ERJT06J102V; Power: 0.25W; Tolerance: 0.05; LatestRevision Note: Initial Release; Published: 8-Jun-2000; LatestRevisionDate: 17-Jul-2002; LatestRevisionNote: Re-released for DXP Platform.; PackageReference: AXIAL-0.4; Publisher: Altium Limited; Part Number: 1K; Type: Film; Package: 0805; Component Type: Standard; LatestRevision Date: 30-7-2010; Author: Willy Pietersz; ROHS: Y; Supplier 1: Farnell; Supplier Part Number 1: 1618241; ComponentLink1Description: Manufacturer; ComponentLink2Description: Datasheet

## Nets that join several sheets
3v3: main (10 pins), Subsheets combined (D4.1), Accelerometer 3-AXIS - BMA180 (7 pins), U_Subsheets combined/PSU 3v3 (C29.2 C30.2 U9.3)
3v3A: Accelerometer 3-AXIS - BMA180 (C7.2 U2.2), U_Subsheets combined/PSU 3v3A (C24.2 C26.2 U7.3)
5v0: main (P11.6), Subsheets combined (5 pins), U_Subsheets combined/PSU 3v3 (C31.2 U9.2), U_Subsheets combined/PSU 3v3A (C25.2 U7.2), U_Subsheets combined/ServoConnector1 (P2.2 R4.2), U_Subsheets combined/ServoConnector2 (P9.2 R24.2), U_Subsheets combined/ServoConnector3 (P20.2 R31.2), U_Subsheets combined/ServoConnector4 (P16.2 R29.2), U_Subsheets combined/ServoConnector5 (P8.2 R15.2), U_Subsheets combined/ServoConnector6 (P7.2 R14.2), U_Subsheets combined/ServoConnector7 (P6.2 R11#2.2), U_Subsheets combined/ServoConnector8 (P5.2 R10#2.2), U_Subsheets combined/ServoConnector9 (P4.2 R18.2)
GND: main (13 pins), Subsheets combined (9 pins), U_Subsheets combined/PSU 3v3 (C29.1 C30.1 C31.1 U9.1), Power Entry 24v-3pin Fused-1A5 (P3.1), U_Subsheets combined/ServoConnector1 (P2.1), U_Subsheets combined/ServoConnector2 (P9.1), U_Subsheets combined/ServoConnector3 (P20.1), U_Subsheets combined/ServoConnector4 (P16.1), U_Subsheets combined/ServoConnector5 (P8.1), U_Subsheets combined/ServoConnector6 (P7.1), U_Subsheets combined/ServoConnector7 (P6.1), U_Subsheets combined/ServoConnector8 (P5.1), U_Subsheets combined/ServoConnector9 (P4.1)
GNDA: Subsheets combined (R11#1.1), Accelerometer 3-AXIS - BMA180 (C7.1 C8.1 P1.7 U2.3), U_Subsheets combined/PSU 3v3A (C24.1 C25.1 C26.1 U7.1)
Input 11.1v: Subsheets combined (SW4.1), Power Entry 24v-3pin Fused-1A5 (D1.2)
imu analog configMode: main (U1.63), Subsheets combined (U5.14)
imu analog x: main (U1.27), Subsheets combined (U5.6)
imu analog y: main (U1.28), Subsheets combined (U5.7)
imu analog z: main (U1.29), Subsheets combined (U5.8)
imu interrupt: main (U1.8), Subsheets combined (U5.5)
imu pwm x: main (U1.4), Subsheets combined (U5.2)
imu pwm y: main (U1.5), Subsheets combined (U5.3)
imu pwm z: main (U1.6), Subsheets combined (U5.4)
INT0 Accelerometer: main (U1.30), Accelerometer 3-AXIS - BMA180 (P1.6 U2.4)
LED1: main (U1.23), Subsheets combined (D5.2)
LED2: main (U1.24), Subsheets combined (D6.2)
LED3: main (U1.22), Subsheets combined (D7.2)
SCL: main (U1.37), Accelerometer 3-AXIS - BMA180 (P1.4 U2.7)
SDA: main (U1.36), Accelerometer 3-AXIS - BMA180 (P1.2 U2.9)
ServoSig1: main (U1.46), U_Subsheets combined/ServoConnector1 (R2.2)
ServoSig2: main (U1.49), U_Subsheets combined/ServoConnector2 (R23.2)
ServoSig3: main (U1.50), U_Subsheets combined/ServoConnector3 (R30.2)
ServoSig4: main (U1.51), U_Subsheets combined/ServoConnector4 (R28.2)
ServoSig5: main (U1.42), U_Subsheets combined/ServoConnector5 (R16.2)
ServoSig6: main (U1.43), U_Subsheets combined/ServoConnector6 (R13#2.2)
ServoSig7: main (U1.44), U_Subsheets combined/ServoConnector7 (R12#2.2)
ServoSig8: main (U1.45), U_Subsheets combined/ServoConnector8 (R9#2.2)
ServoSig9: main (U1.52), U_Subsheets combined/ServoConnector9 (R7.2)
SW1: main (U1.47), Subsheets combined (SW2.2 SW2.3)
SW2: main (U1.48), Subsheets combined (SW3.2 SW3.3)